# Altium schematic sheet Sound Connector.SchDoc
size A4
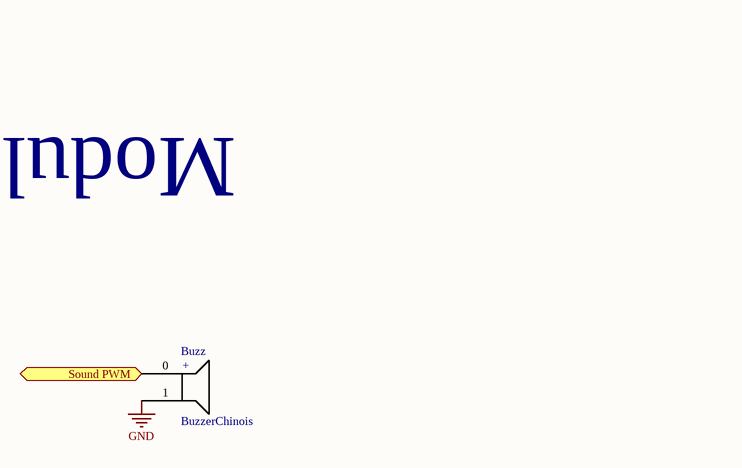
[diagram p0: Sound Connector.SchDoc]

## Parts
Buzz  BuzzerChinois  [BuzzerChinois]

## Ports
Sound PWM (in)

## Nets
GND: Buzz.1(Moins)
Sound PWM: Buzz.0(Plus) ; port Sound PWM

## Notes on the sheet
- Module son
- (in symbol BuzzerChinois) +